# Altium project DMESC.PrjPcb
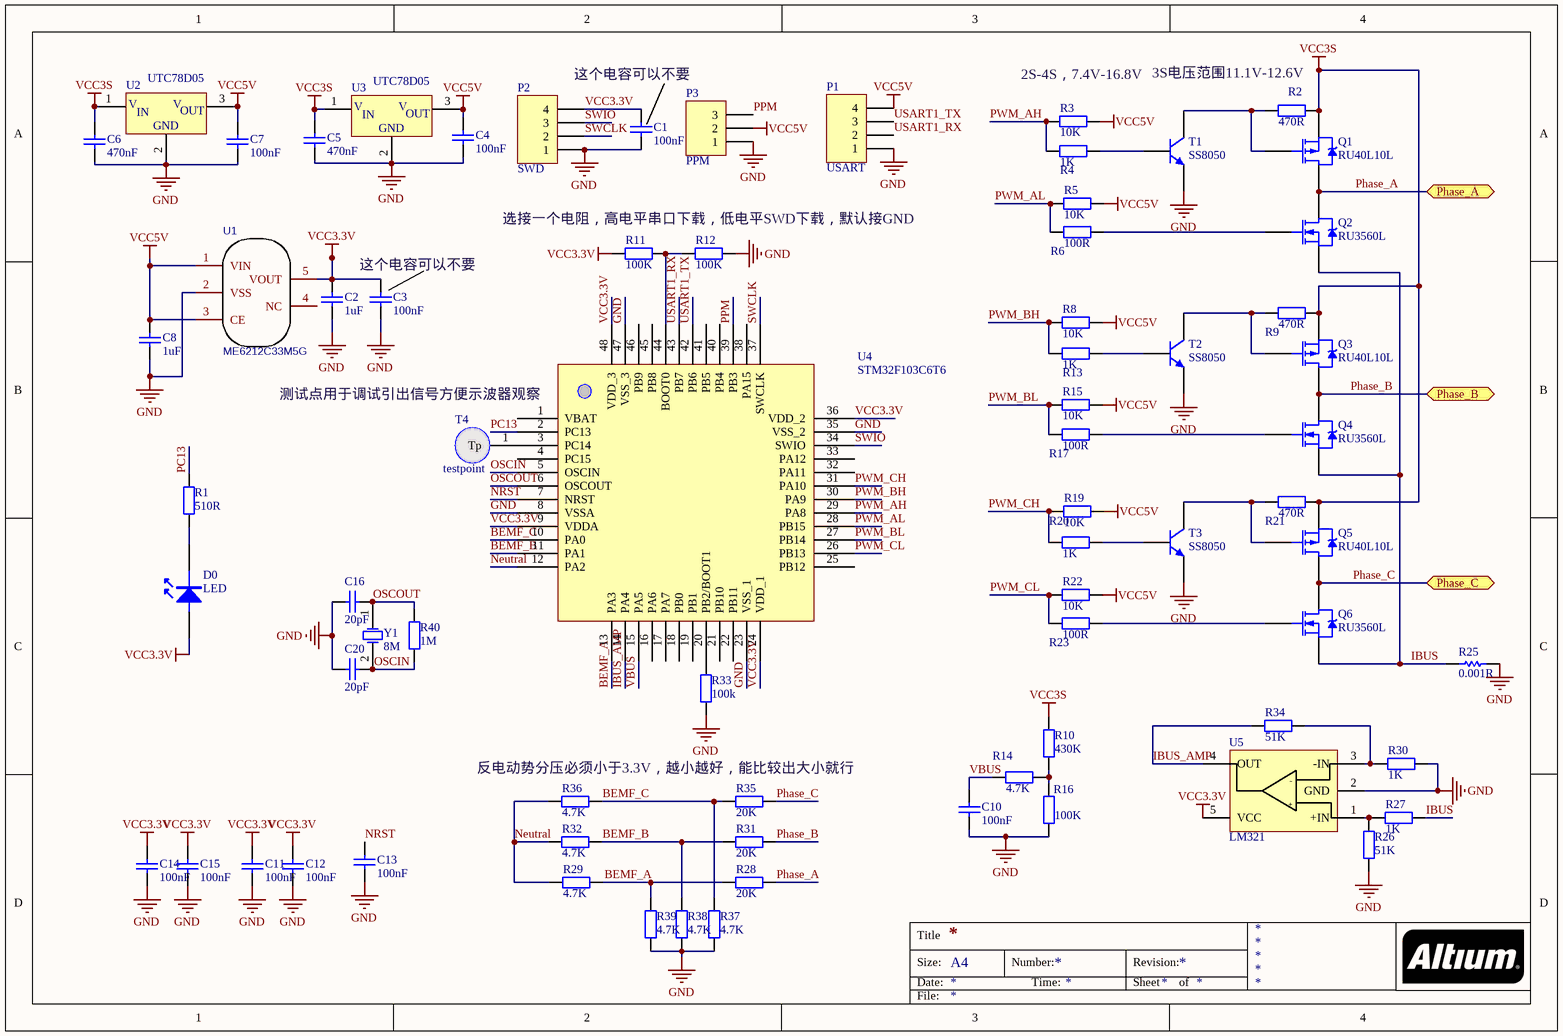
[diagram p0: DMESC.SchDoc]
1 sheet, 73 parts. Net scope: flat (ports and power ports of the same name join across sheets).
Board files: DMESC.PcbDoc, PCB1.PcbDoc

## Sheet DMESC.SchDoc
size A4

### Parts
C1  100nF  [C0603]
C2  1uF  [C0603]
C3  100nF  [C0603]
C4  100nF  [C0603]
C5  470nF  [C0603]
C6  470nF  [C0603]
C7  100nF  [C0603]
C8  1uF  [C0603]
C10  100nF  [C0603]
C11  100nF  [C0603]
C12  100nF  [C0603]
C13  100nF  [C0603]
C14  100nF  [C0603]
C15  100nF  [C0603]
C16  20pF  [C0603]
C20  20pF  [C0603]
D0  LED  [0603LED]
P1  USART  [HDR1X4]
P2  SWD  [HDR1X4]
P3  PPM  [HDR1X3]
Q1  RU40L10L  [TO-252]
Q2  RU3560L  [TO-252]
Q3  RU40L10L  [TO-252]
Q4  RU3560L  [TO-252]
Q5  RU40L10L  [TO-252]
Q6  RU3560L  [TO-252]
R1  510R  [R0603]
R2  470R  [R0603]
R3  10K  [R0603]
R4  1K  [R0603]
R5  10K  [R0603]
R6  100R  [R0603]
R8  10K  [R0603]
R9  470R  [R0603]
R10  430K  [R0603]
R11  100K  [R0603]
R12  100K  [R0603]
R13  1K  [R0603]
R14  4.7K  [R0603]
R15  10K  [R0603]
R16  100K  [R0603]
R17  100R  [R0603]
R19  10K  [R0603]
R20  1K  [R0603]
R21  470R  [R0603]
R22  10K  [R0603]
R23  100R  [R0603]
R25  0.001R  [2512]
R26  51K  [R0603]
R27  1K  [R0603]
R28  20K  [R0603]
R29  4.7K  [R0603]
R30  1K  [R0603]
R31  20K  [R0603]
R32  4.7K  [R0603]
R33  100k  [R0603]
R34  51K  [R0603]
R35  20K  [R0603]
R36  4.7K  [R0603]
R37  4.7K  [R0603]
R38  4.7K  [R0603]
R39  4.7K  [R0603]
R40  1M  [R0603]
T1  SS8050  [SOT-23]
T2  SS8050  [SOT-23]
T3  SS8050  [SOT-23]
T4  testpoint  [testpoint]
U1  ME6212C33M5G  [ME6212C33M5G]
U2  UTC78D05  [TO-252]
U3  UTC78D05  [TO-252]
U4  STM32F103C6T6  [STM32F103C6T6]
U5  LM321  [SOT23-5]
Y1  8M  [3225]

### Ports
Phase_A (bidir), Phase_B (bidir), Phase_C (bidir)

### Nets
GND: C1.1 C2.1 C3.1 C4.1 C5.1 C6.1 C7.1 C8.1 C10.1 C11.1 C12.1 C13.2 C14.1 C15.1 C16.1 C20.1 P1.1 P2.1 P3.1 R12.2 R16.1 R25.2 R26.2 R30.1 R33.1 R37.1 R38.1 R39.1 T1.2(E) T2.2(E) T3.2(E) U1.2(VSS) U2.2(GND) U3.2(GND) U4.8(VSSA) U4.23(VSS_1) U4.35(VSS_2) U4.47(VSS_3) U5.2(GND)
VCC3.3V: C1.2 C2.2 C3.2 C11.2 C12.2 C14.2 C15.2 D0.1 P2.4 R11.2 U1.5(VOUT) U4.9(VDDA) U4.24(VDD_1) U4.36(VDD_2) U4.48(VDD_3) U5.5(VCC)
VCC3S: C5.2 C6.2 Q1.3(S) Q3.3(S) Q5.3(S) R2.2 R9.2 R10.2 R21.2 U2.1(VIN) U3.1(VIN)
VCC5V: C4.2 C7.2 C8.2 P1.4 P3.2 R3.2 R5.2 R8.2 R15.2 R19.2 R22.2 U1.1(VIN) U1.3(CE) U2.3(VOUT) U3.3(VOUT)
BEMF_A: R28.2 R29.1 R39.2 U4.13(PA3)
BEMF_B: R31.2 R32.1 R38.2 U4.11(PA1)
BEMF_C: R35.2 R36.1 R37.2 U4.10(PA0)
IBUS: Q2.3(S) Q4.3(S) Q6.3(S) R25.1 R27.1
IBUS_AMP: R34.2 U4.14(PA4) U5.4(OUT)
Neutral: R29.2 R32.2 R36.2 U4.12(PA2)
NRST: C13.1 U4.7(NRST)
OSCIN: C20.2 R40.1 U4.5(OSCIN) Y1.2
OSCOUT: C16.2 R40.2 U4.6(OSCOUT) Y1.1
PC13: R1.1 U4.2(PC13)
Phase_A: Q1.2(D) Q2.2(D) R28.1 ; port Phase_A
Phase_B: Q3.2(D) Q4.2(D) R31.1 ; port Phase_B
Phase_C: Q5.2(D) Q6.2(D) R35.1 ; port Phase_C
PPM: P3.3 U4.39(PB3)
PWM_AH: R3.1 R4.1 U4.29(PA8)
PWM_AL: R5.1 R6.1 U4.28(PB15)
PWM_BH: R8.1 R13.1 U4.30(PA9)
PWM_BL: R15.1 R17.1 U4.27(PB14)
PWM_CH: R19.1 R20.1 U4.31(PA10)
PWM_CL: R22.1 R23.1 U4.26(PB13)
SWCLK: P2.2 U4.37(SWCLK)
SWIO: P2.3 U4.34(SWIO)
USART1_RX: P1.2 U4.43(PB7)
USART1_TX: P1.3 U4.42(PB6)
VBUS: C10.2 R14.1 U4.15(PA5)
NetD0_2: D0.2 R1.2
NetQ1_1: Q1.1(G) R2.1 T1.3(C)
NetQ2_1: Q2.1(G) R6.2
NetQ3_1: Q3.1(G) R9.1 T2.3(C)
NetQ4_1: Q4.1(G) R17.2
NetQ5_1: Q5.1(G) R21.1 T3.3(C)
NetQ6_1: Q6.1(G) R23.2
NetR4_2: R4.2 T1.1(B)
NetR10_1: R10.1 R14.2 R16.2
NetR11_1: R11.1 R12.1 U4.44(BOOT0)
NetR13_2: R13.2 T2.1(B)
NetR20_2: R20.2 T3.1(B)
NetR26_1: R26.1 R27.2 U5.1(+IN)
NetR30_2: R30.2 R34.1 U5.3(-IN)
NetR33_2: R33.2 U4.20(PB2/BOOT1)
NetT4_1: T4.1(Tp) U4.3(PC14)

Not connected (* = marked no-connect by the designer): U1 4(NC); U4 1(VBAT) 4(PC15) 16(PA6) 17(PA7) 18(PB0) 19(PB1) 21(PB10) 22(PB11) 25(PB12) 32(PA11) 33(PA12) 38(PA15) 40(PB4) 41(PB5) 45(PB8) 46(PB9)

### Notes on the sheet
- 这个电容可以不要
- (near R3) 2S-4S，7.4V-16.8V
- (near R2) 3S电压范围11.1V-12.6V
- 选接一个电阻，高电平串口下载，低电平SWD下载，默认接GND
- (near C3) 这个电容可以不要
- 测试点用于调试引出信号方便示波器观察
- (near R36) 反电动势分压必须小于3.3V，越小越好，能比较出大小就行
- Title
- Size:
- Date:
- A4
- Number:
- Time:
- Revision:
- Sheet
- of
- File:
- (in symbol 78L05) V; IN; OUT
- (in symbol LM321) -; +

### Library data of the parts
C1 C3 C11-C15 = Cap: 0.1uF; Value: 100pF; Published: 8-Jun-2000; LatestRevisionDate: 17-Jul-2002; LatestRevisionNote: Re-released for DXP Platform.; PackageReference: RAD-0.3; Publisher: Altium Limited; PackageDescription: Radial Cap, Thru-Hole; 2 Leads; 0.3 in Pin Spacing
C2 C8 = Cap: Value: 100pF; Published: 8-Jun-2000; LatestRevisionDate: 17-Jul-2002; LatestRevisionNote: Re-released for DXP Platform.; PackageReference: RAD-0.3; Publisher: Altium Limited; PackageDescription: Radial Cap, Thru-Hole; 2 Leads; 0.3 in Pin Spacing
C4-C7 = Cap: 贴片电容; Value: 100pF; Published: 8-Jun-2000; LatestRevisionDate: 17-Jul-2002; LatestRevisionNote: Re-released for DXP Platform.; PackageReference: RAD-0.3; Publisher: Altium Limited; PackageDescription: Radial Cap, Thru-Hole; 2 Leads; 0.3 in Pin Spacing
C10 = Cap: Capacitor; Value: 0.1uF; Published: 8-Jun-2000; LatestRevisionDate: 17-Jul-2002; LatestRevisionNote: Re-released for DXP Platform.; PackageReference: RAD-0.3; Publisher: Altium Limited
C16 C20 = Cap: 0603; Value: 104; Published: 8-Jun-2000; LatestRevisionDate: 17-Jul-2002; LatestRevisionNote: Re-released for DXP Platform.; Publisher: Altium Limited
P1 P2 = Header 4: Header, 4-Pin; LatestRevisionDate: 17-Jul-2002; LatestRevisionNote: Re-released for DXP Platform.; Publisher: Altium Limited
P3 = Header 3: Header, 3-Pin; LatestRevisionDate: 17-Jul-2002; LatestRevisionNote: Re-released for DXP Platform.; Publisher: Altium Limited
Q1 Q3 Q5 = IRFR5305: PMOSFET; Manufacturer: International Rectifier; Class I: Discrete; Class II: MOSFET - Power; Note: Pin 2 is trimmed and is electrically connected to Drain.; Published: 8-Jun-2000; Revision: July-2002: Re-released for DXP Platform.; Datasheet: Latest Revision: PD-9.1402; Package Reference: TO-252AA; Publisher: Altium Limited
Q2 Q4 Q6 = IRFR1205: NMOSFET; Manufacturer: International Rectifier; Class I: Discrete; Class II: MOSFET - Power; Note: Pin 2 is trimmed and is electrically connected to Drain.; Published: 8-Jun-2000; Revision: July-2002: Re-released for DXP Platform.; Datasheet: Latest Revision: PD-91318B; Package Reference: TO-252AA; Publisher: Altium Limited
R1 R11 R12 R33 R40 = Res2: 0603; Published: 8-Jun-2000; LatestRevisionDate: 17-Jul-2002; LatestRevisionNote: Re-released for DXP Platform.; Publisher: Altium Limited
R2 R6 R9 R17 R21 R23 = Res2: Resistor; Value: 470; Published: 8-Jun-2000; LatestRevisionDate: 17-Jul-2002; LatestRevisionNote: Re-released for DXP Platform.; PackageReference: 1608[0603]; Publisher: Altium Limited
R3-R5 R8 R15 R19 R22 R28 R29 R31 R32 R35-R39 = Res2: Resistor; Value: 4K7; Published: 8-Jun-2000; LatestRevisionDate: 17-Jul-2002; LatestRevisionNote: Re-released for DXP Platform.; PackageReference: 1608[0603]; Publisher: Altium Limited
R10 R14 R16 R26 R27 R30 R34 = Res2: Resistor; Value: 10K; Published: 8-Jun-2000; LatestRevisionDate: 17-Jul-2002; LatestRevisionNote: Re-released for DXP Platform.; PackageReference: 1608[0603]; Publisher: Altium Limited
R13 R20 = Res2: Resistor; Value: 4k7; Published: 8-Jun-2000; LatestRevisionDate: 17-Jul-2002; LatestRevisionNote: Re-released for DXP Platform.; PackageReference: 1608[0603]; Publisher: Altium Limited
R25 = Res1: 11毫欧采样电阻; Value: 1K; Published: 8-Jun-2000; LatestRevisionDate: 17-Jul-2002; LatestRevisionNote: Re-released for DXP Platform.; PackageReference: AXIAL-0.3; Publisher: Altium Limited; PackageDescription: Axial Device, Thru-Hole; 2 Leads; 0.3 in Pin Spacing
T1-T3 = 2N3904: NPN三极管
T4 = testpoint: 测试点用焊盘代替，不需要元器件
U1 = ME6212C33M5G: BOM_Manufacturer: MICRONE; BOM_Supplier: LCSC; BOM_Manufacturer Part: ME6212C33M5G; BOM_Supplier Part: C81233; BOM_JLCPCB Part Class: Extended Part; spicePre: U; spiceSymbolName: ME6212C33M5G
U2 U3 = 78L05: 线性稳压
U4 = STM32F103C8T6
U5 = LM321: 单路运放
Y1 = XTAL: Crystal Oscillator; Published: 8-Jun-2000; LatestRevisionDate: 17-Jul-2002; LatestRevisionNote: Re-released for DXP Platform.; Publisher: Altium Limited